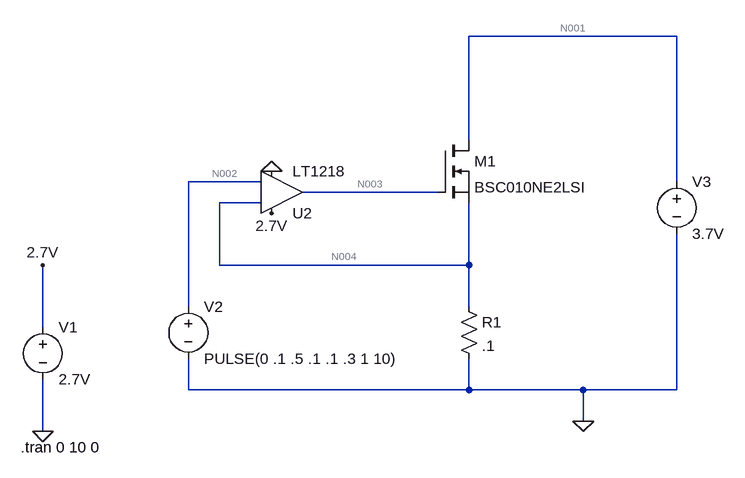
[diagram p0: schematic OpAmpFetResistor.asc]
OpAmpFetResistor.asc, the LTspice schematic file:
Version 4
SHEET 1 880 680
WIRE 528 -160 208 -160
WIRE 208 0 208 -160
WIRE -112 64 -224 64
WIRE 528 64 528 -160
WIRE 160 80 -48 80
WIRE -112 96 -176 96
WIRE -176 192 -176 96
WIRE 208 192 208 96
WIRE 208 192 -176 192
WIRE -224 256 -224 64
WIRE 208 256 208 192
WIRE -448 288 -448 192
WIRE -224 384 -224 336
WIRE 208 384 208 336
WIRE 208 384 -224 384
WIRE 384 384 208 384
WIRE 528 384 528 144
WIRE 528 384 384 384
WIRE 384 432 384 384
WIRE -448 448 -448 368
FLAG 384 432 0
FLAG -448 448 0
FLAG -448 192 2.7V
FLAG -96 112 2.7V
FLAG -96 48 0
SYMBOL voltage -448 272 R0
SYMATTR InstName V1
SYMATTR Value 2.7V
SYMBOL voltage -224 240 R0
WINDOW 123 0 0 Left 2
WINDOW 39 0 0 Left 2
SYMATTR InstName V2
SYMATTR Value PULSE(0 .1 .5 .1 .1 .3 1 10)
SYMBOL voltage 528 48 R0
SYMATTR InstName V3
SYMATTR Value 3.7V
SYMBOL res 192 240 R0
SYMATTR InstName R1
SYMATTR Value .1
SYMBOL nmos 160 0 R0
SYMATTR InstName M1
SYMATTR Value BSC010NE2LSI
SYMBOL Opamps\\LT1218 -80 80 M180
SYMATTR InstName U2
TEXT -482 472 Left 2 !.tran 0 10 0

The netlist it stands for:
* OpAmpFetResistor.asc
V1 2.7V 0 2.7V
V2 N002 0 PULSE(0 .1 .5 .1 .1 .3 1 10)
V3 N001 0 3.7V
R1 N004 0 .1
M1 N001 N003 N004 N004 BSC010NE2LSI
XU2 N002 N004 2.7V 0 N003 NC_01 LT1218
.model NMOS NMOS
.model PMOS PMOS
.lib standard.mos
.tran 0 10 0
.lib LTC.lib
.backanno
.end

* Results of the author's LTspice run, read from the files saved beside the schematic
* Operating Point, zero values left out:
*   V(2.7v) = 2.7 V
*   V(n001) = 3.7 V
*   V(n004) = 6.33 nV
*   V(n003) = 1.332 V
*   Id(M1) = 51.16 nA
*   Is(M1) = -51.16 nA
*   I(R1) = 63.3 nA
*   I(V3) = -51.17 nA
*   I(V2) = 12.13 nA
*   I(V1) = -305.9 µA
*   Ix(u2:1) = -12.13 nA
*   Ix(u2:2) = -12.13 nA
*   Ix(u2:3) = 305.9 µA
*   Ix(u2:4) = -305.9 µA
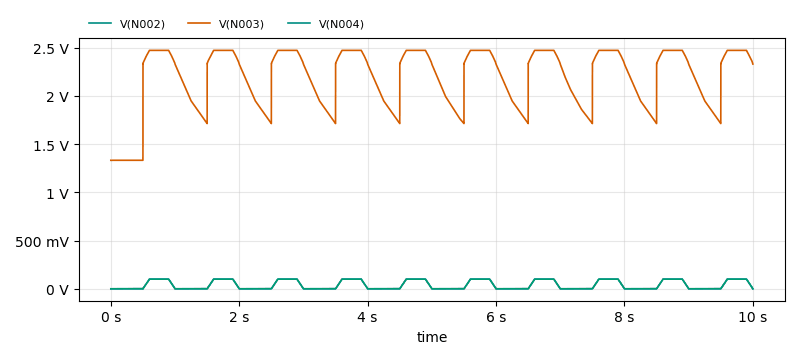
[diagram p1: Transient Analysis of OpAmpFetResistor.asc, plotted from the saved traces]
* Transient Analysis, 1 run:
*   V(N002): min -44.57 nV, max 100 mV, average 40 mV, rms 61.08 mV, last 0 V
*   V(N003): min 1.332 V, max 2.472 V, average 2.182 V, rms 2.207 V, last 2.33 V
*   V(N004): min 0 V, max 100 mV, average 40 mV, rms 61.08 mV, last 577.9 nV